# EAGLE design fff (EAGLE 4.13)
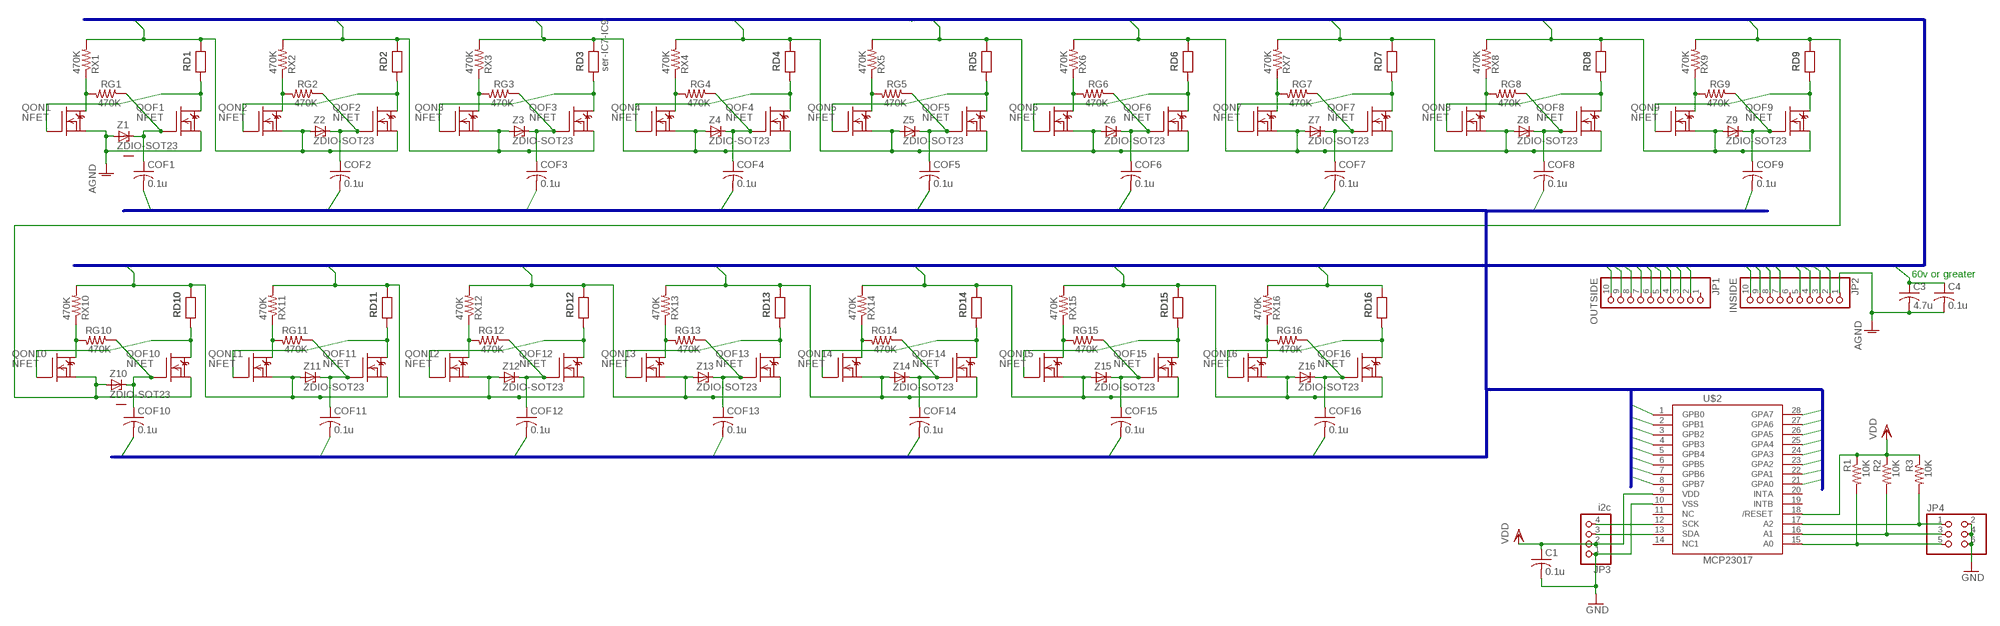
[diagram p0: schematic, sheet 1]

## Parts
C1  0.1u  C-USC0603  [C0603]
C3  4.7u  C-USC0805  [C0805]
C4  0.1u  C-USC0603  [C0603]
COF1  0.1u  C-USC0603  [C0603]
COF2  0.1u  C-USC0603  [C0603]
COF3  0.1u  C-USC0603  [C0603]
COF4  0.1u  C-USC0603  [C0603]
COF5  0.1u  C-USC0603  [C0603]
COF6  0.1u  C-USC0603  [C0603]
COF7  0.1u  C-USC0603  [C0603]
COF8  0.1u  C-USC0603  [C0603]
COF9  0.1u  C-USC0603  [C0603]
COF10  0.1u  C-USC0603  [C0603]
COF11  0.1u  C-USC0603  [C0603]
COF12  0.1u  C-USC0603  [C0603]
COF13  0.1u  C-USC0603  [C0603]
COF14  0.1u  C-USC0603  [C0603]
COF15  0.1u  C-USC0603  [C0603]
COF16  0.1u  C-USC0603  [C0603]
JP1  OUTSIDE  PINHD-1X10  [1X10]
JP2  INSIDE  PINHD-1X10  [1X10]
JP3  i2c  PINHD-1X4  [1X04]
JP4  PINHD-2X3  [2X03]
QOF1  NFET  DMN3404L  [SOT-23]
QOF2  NFET  DMN3404L  [SOT-23]
QOF3  NFET  DMN3404L  [SOT-23]
QOF4  NFET  DMN3404L  [SOT-23]
QOF5  NFET  DMN3404L  [SOT-23]
QOF6  NFET  DMN3404L  [SOT-23]
QOF7  NFET  DMN3404L  [SOT-23]
QOF8  NFET  DMN3404L  [SOT-23]
QOF9  NFET  DMN3404L  [SOT-23]
QOF10  NFET  DMN3404L  [SOT-23]
QOF11  NFET  DMN3404L  [SOT-23]
QOF12  NFET  DMN3404L  [SOT-23]
QOF13  NFET  DMN3404L  [SOT-23]
QOF14  NFET  DMN3404L  [SOT-23]
QOF15  NFET  DMN3404L  [SOT-23]
QOF16  NFET  DMN3404L  [SOT-23]
QON1  NFET  DMN3404L  [SOT-23]
QON2  NFET  DMN3404L  [SOT-23]
QON3  NFET  DMN3404L  [SOT-23]
QON4  NFET  DMN3404L  [SOT-23]
QON5  NFET  DMN3404L  [SOT-23]
QON6  NFET  DMN3404L  [SOT-23]
QON7  NFET  DMN3404L  [SOT-23]
QON8  NFET  DMN3404L  [SOT-23]
QON9  NFET  DMN3404L  [SOT-23]
QON10  NFET  DMN3404L  [SOT-23]
QON11  NFET  DMN3404L  [SOT-23]
QON12  NFET  DMN3404L  [SOT-23]
QON13  NFET  DMN3404L  [SOT-23]
QON14  NFET  DMN3404L  [SOT-23]
QON15  NFET  DMN3404L  [SOT-23]
QON16  NFET  DMN3404L  [SOT-23]
R1  10K  R-US_R0603  [R0603]
R2  10K  R-US_R0603  [R0603]
R3  10K  R-US_R0603  [R0603]
RD1  RESEU-S2,5  [RS-2,5@1]
RD2  RESEU-S2,5  [RS-2,5@1]
RD3  ser-IC7-IC9  RESEU-S2,5  [RS-2,5@1]
RD4  RESEU-S2,5  [RS-2,5@1]
RD5  RESEU-S2,5  [RS-2,5@1]
RD6  RESEU-S2,5  [RS-2,5@1]
RD7  RESEU-S2,5  [RS-2,5@1]
RD8  RESEU-S2,5  [RS-2,5@1]
RD9  RESEU-S2,5  [RS-2,5@1]
RD10  RESEU-S2,5  [RS-2,5@1]
RD11  RESEU-S2,5  [RS-2,5@1]
RD12  RESEU-S2,5  [RS-2,5@1]
RD13  RESEU-S2,5  [RS-2,5@1]
RD14  RESEU-S2,5  [RS-2,5@1]
RD15  RESEU-S2,5  [RS-2,5@1]
RD16  RESEU-S2,5  [RS-2,5@1]
RG1  470K  R-US_R0603  [R0603]
RG2  470K  R-US_R0603  [R0603]
RG3  470K  R-US_R0603  [R0603]
RG4  470K  R-US_R0603  [R0603]
RG5  470K  R-US_R0603  [R0603]
RG6  470K  R-US_R0603  [R0603]
RG7  470K  R-US_R0603  [R0603]
RG8  470K  R-US_R0603  [R0603]
RG9  470K  R-US_R0603  [R0603]
RG10  470K  R-US_R0603  [R0603]
RG11  470K  R-US_R0603  [R0603]
RG12  470K  R-US_R0603  [R0603]
RG13  470K  R-US_R0603  [R0603]
RG14  470K  R-US_R0603  [R0603]
RG15  470K  R-US_R0603  [R0603]
RG16  470K  R-US_R0603  [R0603]
RX1  470K  R-US_R0603  [R0603]
RX2  470K  R-US_R0603  [R0603]
RX3  470K  R-US_R0603  [R0603]
RX4  470K  R-US_R0603  [R0603]
RX5  470K  R-US_R0603  [R0603]
RX6  470K  R-US_R0603  [R0603]
RX7  470K  R-US_R0603  [R0603]
RX8  470K  R-US_R0603  [R0603]
RX9  470K  R-US_R0603  [R0603]
RX10  470K  R-US_R0603  [R0603]
RX11  470K  R-US_R0603  [R0603]
RX12  470K  R-US_R0603  [R0603]
RX13  470K  R-US_R0603  [R0603]
RX14  470K  R-US_R0603  [R0603]
RX15  470K  R-US_R0603  [R0603]
RX16  470K  R-US_R0603  [R0603]
U$2  MCP23017  [SO28W]
Z1  ZDIO-SOT23  [SOT-23]
Z2  ZDIO-SOT23  [SOT-23]
Z3  ZDIO-SOT23  [SOT-23]
Z4  ZDIO-SOT23  [SOT-23]
Z5  ZDIO-SOT23  [SOT-23]
Z6  ZDIO-SOT23  [SOT-23]
Z7  ZDIO-SOT23  [SOT-23]
Z8  ZDIO-SOT23  [SOT-23]
Z9  ZDIO-SOT23  [SOT-23]
Z10  ZDIO-SOT23  [SOT-23]
Z11  ZDIO-SOT23  [SOT-23]
Z12  ZDIO-SOT23  [SOT-23]
Z13  ZDIO-SOT23  [SOT-23]
Z14  ZDIO-SOT23  [SOT-23]
Z15  ZDIO-SOT23  [SOT-23]
Z16  ZDIO-SOT23  [SOT-23]

## Nets
AGND: C3.2 C4.2 JP2.1 QOF1.2(S) QON1.2(S) Z1.1(A)
C0: C3.1 C4.1 JP1.10
C1: JP1.5 QOF2.2(S) QON2.2(S) RD1.2 RX1.2 Z2.1(A) Z2.2(NC)
C2: JP2.10 QOF3.2(S) QON3.2(S) RD2.2 RX2.2 Z3.1(A) Z3.2(NC)
C3: JP2.5 QOF4.2(S) QON4.2(S) RD3.2 RX3.2 Z4.1(A) Z4.2(NC)
C4: JP1.9 QOF5.2(S) QON5.2(S) RD4.2 RX4.2 Z5.1(A) Z5.2(NC)
C5: JP1.4 QOF6.2(S) QON6.2(S) RD5.2 RX5.2 Z6.1(A) Z6.2(NC)
C6: JP2.9 QOF7.2(S) QON7.2(S) RD6.2 RX6.2 Z7.1(A) Z7.2(NC)
C7: JP2.4 QOF8.2(S) QON8.2(S) RD7.2 RX7.2 Z8.1(A) Z8.2(NC)
C8: JP1.8 QOF9.2(S) QON9.2(S) RD8.2 RX8.2 Z9.1(A) Z9.2(NC)
C9: JP1.3 QOF10.2(S) QON10.2(S) RD9.2 RX9.2 Z10.1(A)
C10: JP2.8 QOF11.2(S) QON11.2(S) RD10.2 RX10.2 Z11.1(A) Z11.2(NC)
C11: JP2.3 QOF12.2(S) QON12.2(S) RD11.2 RX11.2 Z12.1(A) Z12.2(NC)
C12: JP1.7 QOF13.2(S) QON13.2(S) RD12.2 RX12.2 Z13.1(A) Z13.2(NC)
C13: JP1.2 QOF14.2(S) QON14.2(S) RD13.2 RX13.2 Z14.1(A) Z14.2(NC)
C14: JP2.7 QOF15.2(S) QON15.2(S) RD14.2 RX14.2 Z15.1(A) Z15.2(NC)
C15: JP2.2 QOF16.2(S) QON16.2(S) RD15.2 RX15.2 Z16.1(A) Z16.2(NC)
C16: JP1.6 RD16.2 RX16.2
GND: C1.2 JP3.1 JP4.2 JP4.4 JP4.6 U$2.10(VSS)
GPA0: COF16.2 U$2.21(GPA0)
GPA1: COF15.2 U$2.22(GPA1)
GPA2: COF14.2 U$2.23(GPA2)
GPA3: COF13.2 U$2.24(GPA3)
GPA4: COF12.2 U$2.25(GPA4)
GPA5: COF11.2 U$2.26(GPA5)
GPA6: COF10.2 U$2.27(GPA6)
GPA7: COF1.2 U$2.28(GPA7)
GPB0: COF2.2 U$2.1(GPB0)
GPB1: COF3.2 U$2.2(GPB1)
GPB2: COF4.2 U$2.3(GPB2)
GPB3: COF5.2 U$2.4(GPB3)
GPB4: COF6.2 U$2.5(GPB4)
GPB5: COF7.2 U$2.6(GPB5)
GPB6: COF8.2 U$2.7(GPB6)
GPB7: COF9.2 U$2.8(GPB7)
N$2: JP4.5 R1.2 U$2.15(A0)
N$3: JP4.3 R2.2 U$2.16(A1)
N$4: JP4.1 R3.2 U$2.17(A2)
N$5: JP3.4 U$2.12(SCK)
N$6: QOF10.3(D) QON10.1(G) RD10.1
N$7: JP3.3 U$2.13(SDA)
N$69: COF1.1 QOF1.1(G) RG1.1 Z1.3(C)
N$70: QOF1.3(D) QON1.1(G) RD1.1
N$71: QON1.3(D) RG1.2 RX1.1
N$72: QON2.3(D) RG2.2 RX2.1
N$73: QON3.3(D) RG3.2 RX3.1
N$74: COF2.1 QOF2.1(G) RG2.1 Z2.3(C)
N$75: QOF2.3(D) QON2.1(G) RD2.1
N$77: QON4.3(D) RG4.2 RX4.1
N$78: QON5.3(D) RG5.2 RX5.1
N$79: QON6.3(D) RG6.2 RX6.1
N$80: COF3.1 QOF3.1(G) RG3.1 Z3.3(C)
N$81: QOF3.3(D) QON3.1(G) RD3.1
N$82: QON7.3(D) RG7.2 RX7.1
N$83: QON8.3(D) RG8.2 RX8.1
N$84: QON9.3(D) RG9.2 RX9.1
N$85: QON10.3(D) RG10.2 RX10.1
N$86: COF4.1 QOF4.1(G) RG4.1 Z4.3(C)
N$87: QOF4.3(D) QON4.1(G) RD4.1
N$88: COF5.1 QOF5.1(G) RG5.1 Z5.3(C)
N$89: QOF5.3(D) QON5.1(G) RD5.1
N$90: QON11.3(D) RG11.2 RX11.1
N$91: QON12.3(D) RG12.2 RX12.1
N$92: QON13.3(D) RG13.2 RX13.1
N$93: QON14.3(D) RG14.2 RX14.1
N$94: QON15.3(D) RG15.2 RX15.1
N$95: QON16.3(D) RG16.2 RX16.1
N$126: COF6.1 QOF6.1(G) RG6.1 Z6.3(C)
N$127: QOF6.3(D) QON6.1(G) RD6.1
N$132: COF7.1 QOF7.1(G) RG7.1 Z7.3(C)
N$133: QOF7.3(D) QON7.1(G) RD7.1
N$138: COF8.1 QOF8.1(G) RG8.1 Z8.3(C)
N$139: QOF8.3(D) QON8.1(G) RD8.1
N$144: COF9.1 QOF9.1(G) RG9.1 Z9.3(C)
N$145: QOF9.3(D) QON9.1(G) RD9.1
N$150: COF10.1 QOF10.1(G) RG10.1 Z10.3(C)
N$154: COF11.1 QOF11.1(G) RG11.1 Z11.3(C)
N$155: QOF11.3(D) QON11.1(G) RD11.1
N$158: COF12.1 QOF12.1(G) RG12.1 Z12.3(C)
N$159: QOF12.3(D) QON12.1(G) RD12.1
N$162: COF13.1 QOF13.1(G) RG13.1 Z13.3(C)
N$163: QOF13.3(D) QON13.1(G) RD13.1
N$174: COF14.1 QOF14.1(G) RG14.1 Z14.3(C)
N$175: QOF14.3(D) QON14.1(G) RD14.1
N$179: COF15.1 QOF15.1(G) RG15.1 Z15.3(C)
N$180: QOF15.3(D) QON15.1(G) RD15.1
N$184: COF16.1 QOF16.1(G) RG16.1 Z16.3(C)
N$185: QOF16.3(D) QON16.1(G) RD16.1
VDD: C1.1 JP3.2 R1.1 R2.1 R3.1 U$2.9(VDD) U$2.18(/RESET)
Unconnected: JP1.1 JP2.6 U$2.11(NC) U$2.14(NC1) U$2.19(INTB) U$2.20(INTA) Z1.2(NC) Z10.2(NC)

## Buses
C$1:C[0..18]
GP:GPA[0..7],GPB[0..7]

## Notes on the sheet
- 60v or greater

## Library data of the parts
C1 C3 C4 COF1-COF16 = rcl:C-US: CAPACITOR, American symbol
JP1 JP2 = pinhead:PINHD-1X10: PIN HEADER
JP3 = pinhead:PINHD-1X4: PIN HEADER
JP4 = pinhead:PINHD-2X3: PIN HEADER
QOF1-QOF16 QON1-QON16 = transistor-fet:DMN3404L
R1-R3 RG1-RG16 RX1-RX16 = rcl:R-US_: RESISTOR, American symbol
RD1-RD16 = DEH:RESEU-S2,5
U$2 = 74xx-us:MCP23017
Z1-Z16 = DEH:ZDIO-SOT23

## Board
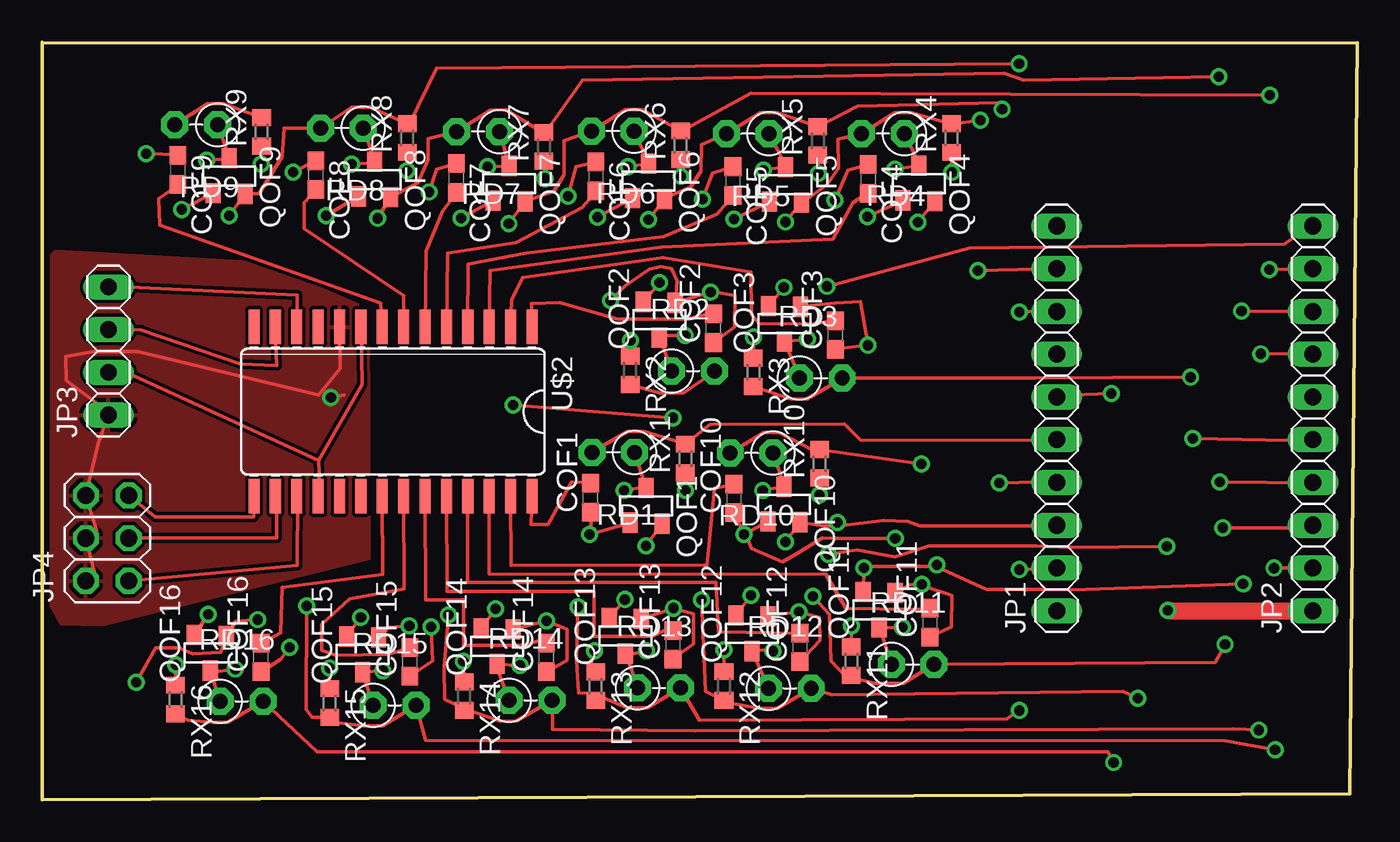
[diagram p1: board, top side]
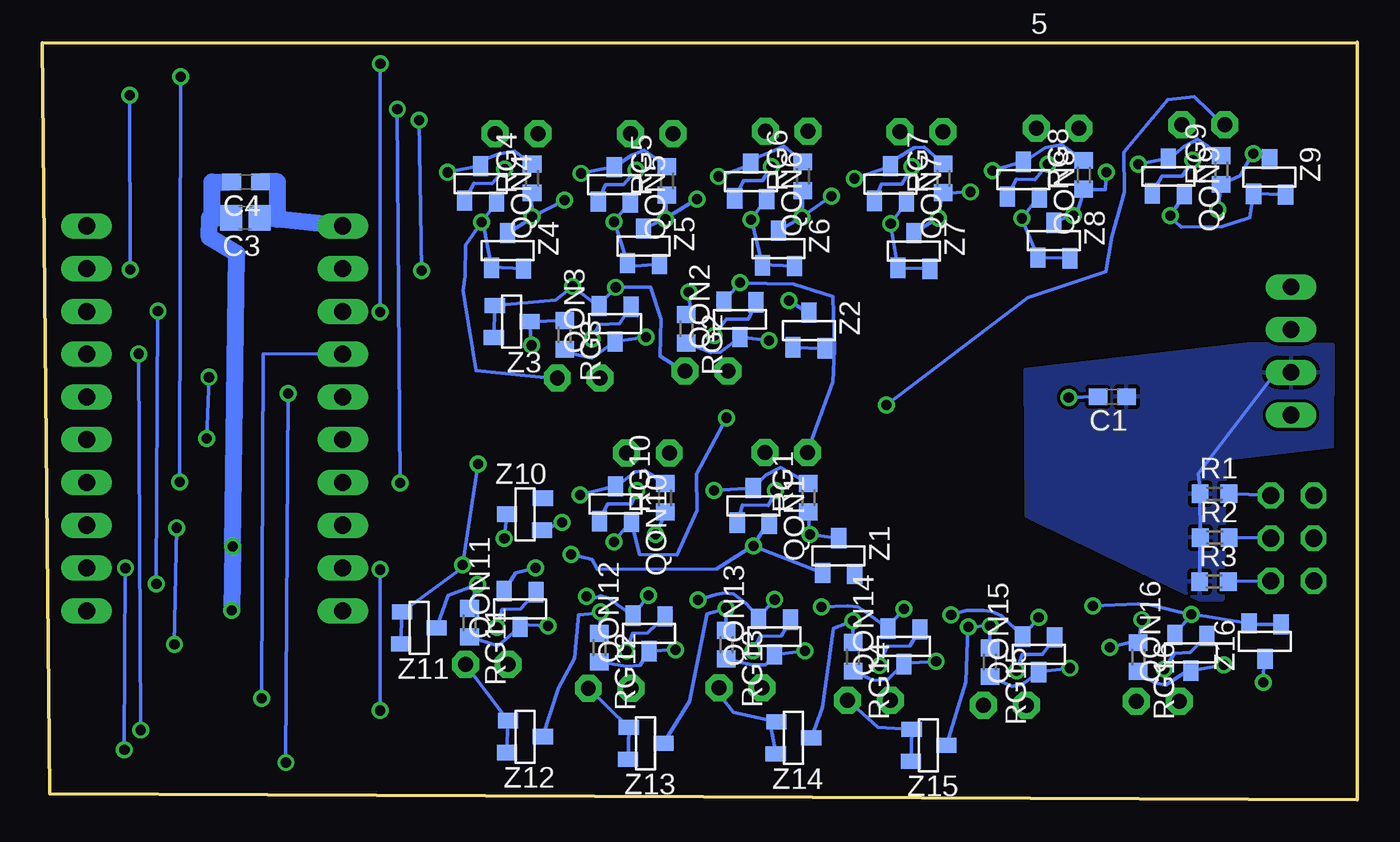
[diagram p2: board, bottom side, seen from below]

Size 78.12 x 45.02 mm. Coordinates in mm from the lower left corner, seen from the top.
Outline: 0,45.02 0.01,0 77.66,0.37 78.12,44.97 0.08,44.94
Copper layers (1*16): Top 0.035mm / dielectric 1.5mm / Bottom 0.035mm
Design rules "default": minimum track width 8mil, minimum drill 0.6mm, track to track 8mil, track to pad 8mil, pad to pad 8mil, via to via 8mil, smd to smd 0mil, copper to edge 8mil, drill to drill 8mil, minimum pad ring 10mil, minimum via ring 8mil, stop-mask expansion 4mil, vias tented up to drill 0mil, thermal gap 10mil

### Footprints (pad centres in the part's own frame; a part is rotated, then mirrored left to right if it is on the bottom)
C0603 = smd 1.1 x 1: 1 -0.85,0; 2 0.85,0
C0805 = smd 1.3 x 1.5: 1 -0.85,0; 2 0.85,0
1X10 = drill 1.016 long: 1 -11.43,0; 2 -8.89,0; 3 -6.35,0; 4 -3.81,0; 5 -1.27,0; 6 1.27,0; 7 3.81,0; 8 6.35,0; 9 8.89,0; 10 11.43,0
1X04 = drill 1 long: 1 -3.81,0; 2 -1.27,0; 3 1.27,0; 4 3.81,0
2X03 = drill 1.016 octagon: 1 -2.54,-1.27; 2 -2.54,1.27; 3 0,-1.27; 4 0,1.27; 5 2.54,-1.27; 6 2.54,1.27
SOT-23 = smd 0.9 x 1.2: 1 -1,-1.006; 2 0.9,-1.056; 3 -0.05,1.056
R0603 = smd 1 x 1.1: 1 -0.85,0; 2 0.85,0
RS-2,5@1 = drill 0.889 pad 1.6 octagon: 1 0,0; 2 2.54,0
SO28W = smd 0.66 x 2.032: 1 -8.255,-5.029; 2 -6.985,-5.029; 3 -5.715,-5.029; 4 -4.445,-5.029; 5 -3.175,-5.029; 6 -1.905,-5.029; 7 -0.635,-5.029; 8 0.635,-5.029; 9 1.905,-5.029; 10 3.175,-5.029; 11 4.445,-5.029; 12 5.715,-5.029; 13 6.985,-5.029; 14 8.255,-5.029; 15 8.255,5.029; 16 6.985,5.029; 17 5.715,5.029; 18 4.445,5.029; 19 3.175,5.029; 20 1.905,5.029; 21 0.635,5.029; 22 -0.635,5.029; 23 -1.905,5.029; 24 -3.175,5.029; 25 -4.445,5.029; 26 -5.715,5.029; 27 -6.985,5.029; 28 -8.255,5.029

### Placement (x,y rotation side)
C1  14.56,23.95 180 bottom
C3  66.04,34.58 180 bottom
C4  66.01,36.71 180 bottom
COF1  32.57,17.95 90 top
COF2  39.87,28.02 90 top
COF3  47.11,27.62 90 top
COF4  49.06,36.89 270 top
COF5  41.03,36.77 270 top
COF6  32.89,37.04 270 top
COF7  24.6,36.95 270 top
COF8  16.26,37.12 270 top
COF9  8.07,37.43 270 top
COF10  41.1,17.9 90 top
COF11  52.74,10.53 90 top
COF12  45.02,9.06 90 top
COF13  37.48,9.22 90 top
COF14  29.95,8.47 90 top
COF15  21.84,8.2 90 top
COF16  13.01,8.47 90 top
JP1  60.26,22.67 90 top
JP2  75.48,22.67 90 top
JP3  3.94,26.67 90 top
JP4  3.87,15.55 90 top
QOF1  35.92,17.47 0 top
QOF2  36.61,28.53 180 top
QOF3  44.04,28.29 180 top
QOF4  52.12,36.62 0 top
QOF5  44.21,36.54 0 top
QOF6  36.07,36.75 0 top
QOF7  27.79,36.61 0 top
QOF8  19.79,36.86 0 top
QOF9  11.17,37.06 0 top
QOF10  44.12,17.55 0 top
QOF11  49.67,11.3 180 top
QOF12  42.12,9.9 180 top
QOF13  34.59,9.75 180 top
QOF14  26.97,9.13 180 top
QOF15  18.98,8.65 180 top
QOF16  9.95,8.74 180 top
QON1  35.83,17.47 0 bottom
QON2  36.72,28.55 180 bottom
QON3  44.15,28.29 180 bottom
QON4  52.03,36.6 0 bottom
QON5  44.09,36.54 0 bottom
QON6  35.98,36.74 0 bottom
QON7  27.69,36.59 0 bottom
QON8  19.79,36.84 0 bottom
QON9  11.18,37.04 0 bottom
QON10  44.02,17.57 0 bottom
QON11  49.78,11.34 180 bottom
QON12  42.12,9.89 180 bottom
QON13  34.68,9.7 180 bottom
QON14  26.99,9.12 180 bottom
QON15  18.98,8.65 180 bottom
QON16  9.95,8.74 180 bottom
R1  8.49,18.19 0 bottom
R2  8.47,15.59 0 bottom
R3  8.52,12.97 0 bottom
RD1  35.19,20.64 180 top
RD2  37.39,25.48 0 top
RD3  44.98,25.06 0 top
RD4  51.21,39.59 180 top
RD5  43.18,39.57 180 top
RD6  35.16,39.73 180 top
RD7  27.16,39.7 180 top
RD8  19.07,39.91 180 top
RD9  10.42,40.1 180 top
RD10  43.41,20.6 180 top
RD11  50.44,8.05 0 top
RD12  43.14,6.63 0 top
RD13  35.37,6.65 0 top
RD14  27.74,5.92 0 top
RD15  19.67,5.63 0 top
RD16  10.58,5.86 0 top
RG1  32.61,17.95 90 bottom
RG2  39.85,27.99 270 bottom
RG3  47.08,27.62 270 bottom
RG4  49.02,36.91 90 bottom
RG5  41.01,36.78 90 bottom
RG6  32.94,37.05 90 bottom
RG7  24.6,36.93 90 bottom
RG8  16.26,37.14 90 bottom
RG9  8.09,37.42 90 bottom
RG10  41.11,17.95 90 bottom
RG11  52.73,10.53 270 bottom
RG12  45.02,9.05 270 bottom
RG13  37.48,9.22 270 bottom
RG14  29.95,8.5 270 bottom
RG15  21.82,8.18 270 bottom
RG16  13.02,8.49 270 bottom
RX1  38.21,20.28 90 top
RX2  34.93,25.52 270 top
RX3  42.24,25.41 270 top
RX4  54.02,39.32 90 top
RX5  46.07,39.15 90 top
RX6  37.93,38.89 90 top
RX7  29.81,38.8 90 top
RX8  21.68,39.32 90 top
RX9  13.04,39.68 90 top
RX10  46.18,19.97 90 top
RX11  48.06,8.25 270 top
RX12  40.5,6.77 270 top
RX13  32.88,6.76 270 top
RX14  25.07,6.17 270 top
RX15  17.08,5.76 270 top
RX16  7.93,5.97 270 top
U$2  20.84,23.07 180 top
Z1  30.76,14.49 0 bottom
Z2  32.52,27.89 0 bottom
Z3  50.23,28.37 270 bottom
Z4  50.42,32.62 0 bottom
Z5  42.35,32.89 0 bottom
Z6  34.33,32.76 0 bottom
Z7  26.29,32.61 0 bottom
Z8  17.98,33.23 0 bottom
Z9  5.17,37.01 0 bottom
Z10  49.44,17.02 90 bottom
Z11  55.74,10.17 270 bottom
Z12  49.44,3.71 270 bottom
Z13  42.27,3.31 270 bottom
Z14  33.49,3.63 270 bottom
Z15  25.47,3.2 270 bottom
Z16  5.54,9.43 180 bottom

### Tracks (layer width: path | path; a pad name or v marks a point on that pad's centre or on a via)
AGND  (via drill 0.6)
  Top 0.203: v35.87,15.1 QOF1.2 | v66.81,15.05 61.11,15 59.06,15.08 52.68,15.1 50.66,14.43 48.4,14.86 v46.7,14.59
  Top 0.406: 67.05,11.26 67.05,11.38 | v66.85,11.26 67.05,11.26 | 67.05,11.26 67.05,11.24
  Top 1.016: 67.05,11.24 JP2.1
  Bottom 0.203: QON1.2 35.02,16.51 v35.87,15.1 | v46.7,14.59 45.47,14.3 45.12,13.69 38.07,13.73 35.87,15.12 v35.87,15.1 | v35.87,15.1 35.89,15.08 Z1.1
  Bottom 0.406: 68.17,34.55 68.17,34.58 | 68.16,34.55 68.02,34.55 | C4.2 66.98,36.71 66.98,36.7 66.98,36.63
  Bottom 1.016: v66.85,11.26 v66.81,15.05 66.55,32.46 68.19,33.43 68.16,34.55 68.17,34.55 | 68.17,34.58 C3.2 | 68.02,34.55 68.02,36.7 66.98,36.7
C0
  Bottom 0.406: 64.14,34.5 64.17,34.5 64.17,34.58 65.03,34.58 C3.1 | C4.1 | C4.1 | C4.1
  Bottom 1.016: 64.14,34.5 64.14,36.72 C4.1 | JP1.10 65.03,34.58
C1  (via drill 0.6)
  Top 0.203: v36.68,30.74 QOF2.2 | RD1.2 32.65,20.68 34.78,21.89 35.77,21.88 RX1.2 39.68,22.31 47.66,22.33 48.59,21.38 60.32,21.36 JP1.5
  Bottom 0.203: QON2.2 37.6,29.63 v36.68,30.74 36.64,30.69 33.49,30.63 31.14,29.89 31.05,26.75 | 32.39,21.43 32.66,20.69 | 32.39,21.43 31.14,24.85 31.05,26.75 | Z2.1 31.71,26.82 Z2.2 31.49,26.67 31.05,26.75 | 32.39,21.43 32.41,21.44 RD1.2
C2  (via drill 0.6)
  Top 0.203: RX2.2 36.66,24.16 38.11,24.18 40.02,25.51 RD2.2 | v44.05,30.45 QOF3.2 | v46.61,30.51 55.07,32.78 73.77,33.01 75.78,34.37 JP2.10
  Bottom 0.203: 45.09,29.34 QON3.2 | 45.09,29.34 v44.05,30.45 44.08,30.48 41.97,30.48 41.36,28.58 41.42,26.36 40.02,25.47 RD2.2 | 45.09,29.34 v46.61,30.51 46.63,30.46 47.61,29.7 Z3.1 51.25,29.35 Z3.2
C3  (via drill 0.6)
  Top 0.203: RX3.2 44.48,23.81 45.43,23.81 47.54,25.04 RD3.2 59,25.06 v68.21,25.11 | v52.01,34.32 QOF4.2 | JP2.5 75.59,21.32 v68.35,21.46
  Bottom 0.203: QON4.2 51.09,35.54 v52.01,34.32 | v68.21,25.11 v68.35,21.46 | v52.01,34.32 52.98,32.95 52.99,31.12 53.11,30.26 52.99,29.53 52.35,25.5 47.69,25.04 RD3.2 | Z4.2 51.47,31.66 Z4.1 51.94,34.29 v52.01,34.32
C4  (via drill 0.6)
  Top 0.203: 54.04,40.14 RX4.2 | 54.04,40.14 51.62,40.82 50.64,40.82 RD4.2 47.27,39.24 47.29,37.52 46.65,36.59 45.13,35.46 QOF5.2 v44.15,34.34 | 54.04,40.14 v55.72,40.37 | JP1.9 60.3,31.55 v55.57,31.45
  Bottom 0.203: QON5.2 43.22,35.47 v44.15,34.34 44.13,34.31 Z5.1 43.61,31.64 Z5.2 | v55.72,40.37 v55.57,31.45
C5  (via drill 0.6)
  Top 0.203: v36.02,34.47 QOF6.2 37.01,35.76 38.5,36.39 39.14,37.35 39.15,38.94 RD5.2 42.66,40.83 43.65,40.84 46.1,40 RX5.2 48.42,41.22 56.82,41.43 v57.02,41.03 | JP1.4 60.29,18.92 v56.86,18.82
  Bottom 0.203: QON6.2 35.13,35.7 v36.02,34.47 35.99,34.48 Z6.1 35.42,31.79 Z6.2 | v57.02,41.03 v56.86,18.82
C6  (via drill 0.6)
  Top 0.203: 37.97,39.74 RX6.2 | 37.97,39.74 35.62,41 34.64,41 RD6.2 31.01,39.17 31.01,37.15 30.41,36.18 28.7,35.58 QOF7.2 v27.72,34.24 | 37.97,39.74 42.1,41.97 v72.92,41.86 | JP2.9 75.55,31.57 v72.88,31.51
  Bottom 0.203: QON7.2 26.76,35.56 v27.72,34.24 v27.73,34.25 Z7.1 Z7.2 | v72.92,41.86 v72.88,31.51
C7  (via drill 0.6)
  Top 0.203: 29.84,39.59 RX7.2 | 29.84,39.59 27.52,40.99 26.65,40.97 RD7.2 22.93,39.29 22.93,38.03 22.34,36.68 20.68,35.78 QOF8.2 v19.92,34.55 | 29.84,39.59 32.1,42.77 57.11,43.17 58.3,42.77 v69.9,42.96 | JP2.4 75.55,18.84 v69.94,18.89
  Bottom 0.203: QON8.2 18.94,35.82 v19.92,34.55 19.94,34.54 Z8.1 19.04,32.21 Z8.2 | v69.9,42.96 v69.94,18.89
C8  (via drill 0.6)
  Top 0.203: 21.79,40.12 RX8.2 | 21.79,40.12 19.48,41.16 18.39,41.15 RD8.2 14.39,39.92 14.25,38.2 12.9,36.03 12.12,36.03 QOF9.2 v11.11,34.71 | 21.79,40.12 23.42,43.48 v58.03,43.73 | JP1.8 60.41,29.09 v58.05,28.98
  Bottom 0.203: QON9.2 10.26,36.02 v11.11,34.71 11.2,34.72 10.47,34.03 8.06,34.05 6.38,34.6 Z9.1 6.2,36.02 Z9.2 | v58.03,43.73 v58.05,28.98
C9  (via drill 0.6)
  Top 0.203: v44.15,15.32 QOF10.2 46.45,16.28 47.33,16.28 | JP1.3 60.31,16.28 52.13,16.28 51.42,16.55 49.97,16.59 47.33,16.28 | RD9.2 9.83,41.37 10.79,41.36 RX9.2 | v27.97,23.45 v37.47,22.7 | 47.33,16.28 47.33,16.31 v47.24,16.49
  Bottom 0.203: v44.15,15.32 43.17,16.53 QON10.2 42.64,14.58 40.41,14.55 39.23,17.2 39.25,19.37 v37.47,22.7 | v27.97,23.45 19.57,29.83 14.95,31.39 14.59,33.47 13.85,36.12 13.88,38.49 11.25,41.6 9.7,41.77 7.87,40.03 RD9.2 | v47.24,16.49 Z10.1
C10  (via drill 0.6)
  Top 0.203: 48.74,12.32 QOF11.2 v48.81,13.78 48.95,13.86 52.6,13.86 | RD10.2 42.88,21.82 43.78,21.83 45.68,20.81 RX10.2 46.12,20.83 v52.23,19.95 | v71.24,29.03 JP2.8 | v71.33,12.83 61.13,12.48 59.35,12.51 56.07,12.52 53.15,13.85 52.6,13.86 | 52.6,13.86 52.6,13.87 v53.14,13.97
  Bottom 0.203: QON11.2 50,13.5 v48.81,13.78 | v71.33,12.83 v71.24,29.03 | v52.23,19.95 v53.14,13.97 53.09,13.85 Z11.1 56.77,11.13 Z11.2
C11  (via drill 0.6)
  Top 0.203: 48.12,7.25 RX11.2 | 48.12,7.25 49.46,6.92 51.15,6.93 RD11.2 69.67,8.17 v70.26,9.24 | 48.12,7.25 47.71,7.33 46.85,8.26 46.76,11.01 v45.79,12.1 | QOF12.2 41.2,10.95 v42.11,12.14 | JP2.3 75.47,16.17 v70.13,16.17
  Bottom 0.203: v45.79,12.1 45.29,11.99 44.96,12.13 44.51,11.99 QON12.2 v42.11,12.14 | v70.26,9.24 v70.13,16.17 | Z12.2 50.48,4.74 Z12.1 53,8.08 RD11.2
C12  (via drill 0.6)
  Top 0.203: v34.61,11.9 QOF13.2 | v39.16,11.89 39.39,6.46 RX12.2 41.13,5.7 42.59,5.43 43.67,5.45 RD12.2 46.91,6.25 64.2,6.46 v65.07,6.03
  Bottom 0.203: v34.61,11.9 35.61,10.79 QON13.2 35.58,10.85 36.31,11.66 37.06,12.23 37.6,12.31 38.07,12.21 v39.16,11.89 | v65.07,6.03 64.99,26.48 60.34,26.52 JP1.7 | Z13.2 43.26,4.23 Z13.1 45.65,6.59 RD12.2
C13  (via drill 0.6)
  Top 0.203: 32.72,6.32 RX13.2 | 32.72,6.32 34.74,5.48 35.97,5.48 RD13.2 39.06,4.72 57.3,4.82 v58.04,5.31 | v26.93,11.34 QOF14.2 | 32.72,6.32 31.86,6.36 31.73,8.25 v31.82,11.47 | JP1.2 60.3,13.74 v58.05,13.68
  Bottom 0.203: v26.93,11.34 27.98,10.19 QON14.2 27.89,10.2 29.14,11.12 29.67,11.48 30.25,11.52 v31.82,11.47 | v58.04,5.31 v58.05,13.68 | Z14.2 34.9,4.61 Z14.1 37.07,5.2 38.28,6.74 RD13.2
C14  (via drill 0.6)
  Top 0.203: 25.1,5.41 RX14.2 | 25.1,5.41 27.24,4.67 28.17,4.71 RD14.2 30.31,4.18 38.79,4.1 70.76,4.23 v72.26,4.15 | v18.93,10.85 QOF15.2 | 25.1,5.41 23.9,5.97 23.89,7.89 v24.13,10.99 | JP2.7 75.51,26.53 v72.38,26.5
  Bottom 0.203: v18.93,10.85 19.9,9.68 QON15.2 19.92,9.77 21.12,10.92 21.73,11.19 22.22,11.26 23.22,11.26 v24.13,10.99 | v72.26,4.15 v72.38,26.5 | Z15.2 26.47,4.17 Z15.1 28.48,4.3 30.3,5.94 RD14.2
C15  (via drill 0.6)
  Top 0.203: v9.86,11.02 QOF16.2 | v15.71,11.52 15.67,5.37 16.04,4.9 RX15.2 17.35,4.6 19.09,4.4 20.23,4.39 RD15.2 22.79,3.55 70.28,3.51 v73.23,2.97 | JP2.2 75.63,13.77 v73.17,13.77
  Bottom 0.203: QON16.2 10.88,9.77 v9.86,11.02 | v15.71,11.52 13.05,11.63 12.42,11.61 9.85,10.99 v9.86,11.02 | v73.23,2.97 v73.17,13.77 | Z16.1 6.52,10.42 Z16.2 9.88,11.04 v9.86,11.02
C16  (via drill 0.6)
  Top 0.203: RX16.2 8.68,4.72 10.11,4.61 11.03,4.62 RD16.2 16.33,2.86 63.3,2.87 v63.64,2.22 | JP1.6 60.34,24.01 v63.51,24.14
  Bottom 0.203: v63.64,2.22 v63.51,24.14
GND  (via drill 0.6)
  Top 0.203: JP4.2 3.16,13.34 JP4.4 3.23,15.98 JP4.6 3.34,21.16 3.99,23.01 1.42,24.9 1.4,26.35 3.06,26.64 5.69,26.64 16.43,24.06 17.7,25.64 17.67,28.15 | v17.15,23.91 17.95,24.06
  Bottom 0.203: C1.2 v17.15,23.91
  pour Top (rank 3): 0.8,32.6 12.91,31.92 19.37,29.17 19.43,14.36 3.57,10.39 1.13,10.45 0.55,11.53 0.57,32.38
GPA0
  Top 0.203: U$2.21 20.21,13.4 14.26,12.61 14.17,9.92 13,9.29 COF16.2
GPA1
  Top 0.203: U$2.22 21.5,12.53 18.26,11.93 16.6,10.43 16.6,8.87 17.46,8.6 20.54,8.64 COF15.2
GPA2
  Top 0.203: U$2.23 22.78,11.89 25.03,11.87 25.02,9.17 28.64,9.17 29.45,9.44 29.93,9.46 COF14.2
GPA3
  Top 0.203: U$2.24 24.04,12.4 32.78,12.39 32.78,9.73 36.24,9.73 36.96,10.08 37.52,10.11 COF13.2
GPA4
  Top 0.203: U$2.25 25.26,12.92 40.01,12.91 40.17,9.98 45.04,9.89 COF12.2
GPA5
  Top 0.203: U$2.26 26.55,13.44 46.55,13.4 47.75,11.38 51.76,11.32 52.76,11.38 COF11.2 52.78,11.41
GPA6
  Top 0.203: U$2.27 27.86,13.94 39.5,13.96 39.93,18.5 41.14,18.76 COF10.2
GPA7
  Top 0.203: 29.1,17.52 U$2.28 29.05,16.37 30.06,16.36 31.44,18.89 32.6,18.85 COF1.2
GPB0
  Top 0.203: U$2.1 29.06,29.49 30.73,29.54 34.19,28.57 38.31,28.57 39.68,28.9 COF2.2
GPB1
  Top 0.203: U$2.2 27.88,29.7 28.54,31.02 36.88,32.23 42.1,31.35 42.12,28.84 42.59,28.3 45.84,28.28 47.16,28.5 COF3.2
GPB2
  Top 0.203: U$2.3 26.61,31.44 36.8,32.83 46.98,33.33 48.16,35.49 49.08,36.09 COF4.2
GPB3
  Top 0.203: U$2.4 25.3,31.83 28.73,32.47 36.9,33.47 40.07,34.81 41.08,35.96 COF5.2
GPB4
  Top 0.203: U$2.5 24.08,32.48 28.14,33.11 32.08,35.19 32.95,36.19 COF6.2
GPB5
  Top 0.203: U$2.6 22.82,32.61 23.78,34.98 24.62,36.09 COF7.2
GPB6
  Top 0.203: U$2.7 21.46,29.95 15.57,33.94 15.57,35.48 16.28,36.24 COF8.2
GPB7
  Top 0.203: U$2.8 20.12,29.51 6.98,34.14 6.93,35.73 8.08,36.53 COF9.2
N$2
  Top 0.203: U$2.15 12.58,16.81 6.72,16.81 JP4.5
  Bottom 0.203: JP4.5 5.25,18.11 R1.2
N$3
  Top 0.203: JP4.3 13.93,15.55 13.93,17.94 U$2.16
  Bottom 0.203: JP4.3 5.11,15.56 R2.2
N$4
  Top 0.203: JP4.1 15.16,13.92 15.17,18.04 U$2.17
  Bottom 0.203: JP4.1 5.11,13 R3.2
N$5
  Top 0.203: U$2.12 15.14,29.99 3.93,30.53 JP3.4
N$6  (via drill 0.6)
  Top 0.203: RD10.1 44.11,18.57 QOF10.3 v42.8,18.38
  Bottom 0.203: QON10.1 44.55,17.57 43.12,17.58 v42.8,18.38
N$7
  Top 0.203: U$2.13 13.92,25.81 11.79,25.9 5.89,27.9 3.82,27.99 JP3.3
N$69  (via drill 0.6)
  Top 0.203: QOF1.1 v32.52,15.76 32.61,16.24 32.61,16.64 COF1.1
  Bottom 0.203: RG1.1 32.62,17.07 v32.52,15.76 32.47,15.78 Z1.3
N$70  (via drill 0.6)
  Top 0.203: RD1.1 35.87,18.57 QOF1.3 35.96,18.61 v34.57,18.39
  Bottom 0.203: QON1.1 36.51,17.52 34.99,17.48 v34.57,18.39
N$71  (via drill 0.6)
  Top 0.203: 38.21,19.45 RX1.1 v38.21,18.39
  Bottom 0.203: v38.21,18.39 QON1.3 35.85,18.57 35.14,19.3 34.27,19.74 RG1.2
N$72  (via drill 0.6)
  Top 0.203: RX2.1 v34.95,27.28
  Bottom 0.203: v34.95,27.28 36.68,27.51 QON2.3 36.64,27.51 37.82,26.61 38.4,26.59 RG2.2
N$73  (via drill 0.6)
  Top 0.203: RX3.1 v42.26,27.49
  Bottom 0.203: v42.26,27.49 44.12,27.22 QON3.3 45.46,26.25 46.66,26.51 RG3.2
N$74  (via drill 0.6)
  Top 0.203: COF2.1 41.12,28.1 41.14,29.95 39.81,30.21 v39.71,30.17 QOF2.1 37.7,30.84 37.37,31.55 36.77,31.68 36.09,31.54 34.66,30.54 v33.75,29.67
  Bottom 0.203: RG2.1 39.62,28.88 v39.71,30.17 | Z2.3 32.61,28.92 v33.75,29.67
N$75  (via drill 0.6)
  Top 0.203: RD2.1 QOF2.3 36.68,27.58 v38.2,27.58
  Bottom 0.203: QON2.1 36.18,28.56 37.47,28.58 v38.2,27.58
N$77  (via drill 0.6)
  Top 0.203: v54.04,37.28 RX4.1
  Bottom 0.203: v54.04,37.28 52.08,37.68 QON4.3 51.73,38.09 51.05,38.36 50.06,38.54 RG4.2
N$78  (via drill 0.6)
  Top 0.203: v46.1,37.22 RX5.1
  Bottom 0.203: v46.1,37.22 44.11,37.61 QON5.3 43.07,38.3 42.36,38.61 RG5.2
N$79  (via drill 0.6)
  Top 0.203: v37.95,37.04 RX6.1
  Bottom 0.203: v37.95,37.04 35.97,37.76 QON6.3 36.04,37.77 35.53,38.22 34.81,38.51 34.07,38.85 RG6.2
N$80  (via drill 0.6)
  Top 0.203: COF3.1 v49.06,27.01 49.05,27.04 48.59,29.59 47.1,29.51 QOF3.1
  Bottom 0.203: RG3.1 Z3.3 v49.06,27.01
N$81  (via drill 0.6)
  Top 0.203: RD3.1 45.02,25.06 QOF3.3 v45.46,27.37
  Bottom 0.203: QON3.1 43.83,28.29 45.04,28.25 v45.46,27.37
N$82  (via drill 0.6)
  Top 0.203: v29.87,36.92 RX7.1
  Bottom 0.203: v29.87,36.92 27.76,37.63 QON7.3 27.73,37.62 27.3,38.15 26.31,38.75 25.71,38.79 RG7.2
N$83  (via drill 0.6)
  Top 0.203: v21.69,37.38 RX8.1
  Bottom 0.203: v21.69,37.38 19.68,37.98 QON8.3 19.78,37.91 18.54,38.74 17.56,38.93 RG8.2
N$84  (via drill 0.6)
  Top 0.203: v13.02,37.76 RX9.1
  Bottom 0.203: v13.02,37.76 11.17,38.12 QON9.3 11.21,38.06 10.3,38.8 9.47,39.25 RG9.2
N$85  (via drill 0.6)
  Top 0.203: v46.17,18.11 RX10.1
  Bottom 0.203: RG10.2 42.33,19.57 42.91,19.48 44.06,18.59 QON10.3 44.08,18.66 v46.17,18.11
N$86  (via drill 0.6)
  Top 0.203: v49.03,34.66 QOF4.1 | COF4.1 47.86,37.41 v47.1,35.62
  Bottom 0.203: RG4.1 49.04,36.03 v49.03,34.66 | v49.03,34.66 49.03,34.57 Z4.3 | v49.03,34.66 49,34.65 v47.1,35.62
N$87  (via drill 0.6)
  Top 0.203: RD4.1 52.07,37.82 QOF4.3 52.11,37.67 v50.65,37.46
  Bottom 0.203: QON4.1 52.46,36.65 51.4,36.6 v50.65,37.46
N$88  (via drill 0.6)
  Top 0.203: v41.1,34.51 QOF5.1 | COF5.1 39.81,37.22 v39.22,35.69
  Bottom 0.203: RG5.1 41.03,35.95 v41.1,34.51 | v41.1,34.51 41.09,34.53 Z5.3 | v41.1,34.51 41.12,34.52 v39.22,35.69
N$89  (via drill 0.6)
  Top 0.203: RD5.1 44.21,37.61 QOF5.3 44.11,37.63 v42.84,37.41
  Bottom 0.203: QON5.1 44.65,36.54 43.58,36.55 v42.84,37.41
N$90  (via drill 0.6)
  Top 0.203: RX11.1 v48.07,10.34
  Bottom 0.203: v48.07,10.34 49.82,10.42 QON11.3 51.03,9.14 RG11.2
N$91  (via drill 0.6)
  Top 0.203: RX12.1 40.51,8.58 v40.49,8.91
  Bottom 0.203: v40.49,8.91 42.12,8.86 QON12.3 42.11,8.83 42.6,7.99 43.4,7.94 RG12.2
N$92  (via drill 0.6)
  Top 0.203: RX13.1 32.64,8.03 32.63,8.65 v32.8,8.86
  Bottom 0.203: v32.8,8.86 34.72,8.63 QON13.3 34.66,8.63 35.16,8.03 35.99,8.01 RG13.2
N$93  (via drill 0.6)
  Top 0.203: RX14.1 v25.02,8.23
  Bottom 0.203: v25.02,8.23 27,8.1 QON14.3 27,8.06 27.85,7.19 28.38,7.1 28.8,7.12 RG14.2
N$94  (via drill 0.6)
  Top 0.203: RX15.1 v17.08,7.83
  Bottom 0.203: v17.08,7.83 19.02,7.62 QON15.3 19,7.53 19.89,6.87 20.51,6.75 RG15.2
N$95  (via drill 0.6)
  Top 0.203: RX16.1 v7.93,8.03
  Bottom 0.203: v7.93,8.03 9.93,7.66 QON16.3 10.04,7.7 11.37,6.83 12.06,6.94 RG16.2
N$126  (via drill 0.6)
  Top 0.203: v32.98,34.62 QOF6.1 | COF6.1 31.71,37.62 v31.23,35.88
  Bottom 0.203: RG6.1 32.93,36.17 v32.98,34.62 | v32.98,34.62 32.9,34.66 Z6.3 | v32.98,34.62 33.03,34.63 v31.23,35.88
N$127  (via drill 0.6)
  Top 0.203: RD6.1 36.01,37.85 QOF6.3 36.03,37.79 v34.81,37.61
  Bottom 0.203: QON6.1 36.46,36.78 35.33,36.78 v34.81,37.61
N$132  (via drill 0.6)
  Top 0.203: v24.89,34.57 QOF7.1 | COF7.1 23.43,37.48 v22.98,36.12
  Bottom 0.203: Z7.3 24.85,34.62 v24.89,34.57 24.64,36.1 RG7.1 24.66,36.06 v22.98,36.12
N$133  (via drill 0.6)
  Top 0.203: RD7.1 27.74,37.72 QOF7.3 27.73,37.64 v26.47,37.63
  Bottom 0.203: QON7.1 28.28,36.59 27.04,36.59 v26.47,37.63
N$138  (via drill 0.6)
  Top 0.203: v16.86,34.72 QOF8.1 | v14.91,37.29 COF8.1
  Bottom 0.203: RG8.1 16.28,36.34 | Z8.3 16.66,34.9 v16.86,34.72 16.71,34.84 16.65,34.87 16.32,35.99 16.26,36.27 RG8.1 | v14.91,37.29 14.97,36.25 16.2,36.25 RG8.1
N$139  (via drill 0.6)
  Top 0.203: RD8.1 19.77,37.96 QOF8.3 19.82,37.87 v18.39,37.77
  Bottom 0.203: QON8.1 20.26,36.89 19.15,36.84 v18.39,37.77
N$144  (via drill 0.6)
  Top 0.203: v8.28,35.08 QOF9.1 | COF9.1 8.1,38.33 v6.18,38.4
  Bottom 0.203: v8.28,35.08 RG9.1 6.95,37.08 6.2,38.43 v6.18,38.4 Z9.3
N$145  (via drill 0.6)
  Top 0.203: RD9.1 11.12,38.17 QOF9.3 11.21,38.1 v9.78,38.01
  Bottom 0.203: QON9.1 11.61,37.07 10.4,37.05 v9.78,38.01
N$150  (via drill 0.6)
  Top 0.203: v41.69,15.76 QOF10.1 | v41.69,15.76 41.74,15.72 COF10.1 | v50.67,15.54 47.07,15.52 46.36,15.55 44.89,14.67 43.96,14.13 42.13,14.95 41.82,15.77 v41.69,15.76
  Bottom 0.203: RG10.1 41.1,17.03 v41.69,15.76 | v50.67,15.54 Z10.3
N$154  (via drill 0.6)
  Top 0.203: QOF11.1 50.73,12.34 51.5,12.77 v52.26,12.81 52.24,12.74 54.03,12.16 54,10.28 COF11.1
  Bottom 0.203: RG11.1 v52.26,12.81 v52.25,12.8 54.01,12.14 Z11.3
N$155  (via drill 0.6)
  Top 0.203: RD11.1 50.44,8.09 QOF11.3 49.67,10.23 v51.1,10.25
  Bottom 0.203: QON11.1 49.69,11.35 50.81,11.31 v51.1,10.25
N$158  (via drill 0.6)
  Top 0.203: QOF12.1 43.09,10.93 v44.96,11.18 44.9,11.17 46.18,10.85 46.2,9.49 COF12.1
  Bottom 0.203: RG12.1 v44.96,11.18 44.98,11.12 46.25,10.98 46.5,8.4 47.45,6.66 Z12.3
N$159  (via drill 0.6)
  Top 0.203: v43.41,8.84 42.15,8.93 QOF12.3 43.15,6.65 RD12.1
  Bottom 0.203: QON12.1 42.17,9.91 43.05,9.89 v43.41,8.84
N$162  (via drill 0.6)
  Top 0.203: QOF13.1 v37.5,11.39 v37.51,11.38 38.69,11.04 38.69,9.26 COF13.1
  Bottom 0.203: RG13.1 37.5,10.12 v37.5,11.39 37.53,11.36 38.62,11.06 39.67,5.87 Z13.3
N$163  (via drill 0.6)
  Top 0.203: RD13.1 35.4,6.68 QOF13.3 34.69,8.6 v35.9,8.86
  Bottom 0.203: QON13.1 34.21,9.74 35.47,9.73 v35.9,8.86
N$174  (via drill 0.6)
  Top 0.203: QOF14.1 v29.97,10.63 29.98,10.65 31.17,10.12 31.17,8.3 COF14.1
  Bottom 0.203: RG14.1 29.96,9.39 v29.97,10.63 v29.97,10.64 31.13,10.19 31.77,5.51 Z14.3
N$175  (via drill 0.6)
  Top 0.203: RD14.1 26.94,8.08 QOF14.3 26.98,8.04 v28.38,7.98
  Bottom 0.203: QON14.1 26.58,9.14 27.93,9.12 v28.38,7.98
N$179  (via drill 0.6)
  Top 0.203: QOF15.1 20.6,10.25 v21.81,10.34 | COF15.1 23.18,8.27 v23.1,10.28
  Bottom 0.203: RG15.1 21.85,9.14 v21.81,10.34 v21.82,10.33 v23.1,10.28 23.12,10.27 23.25,7.01 Z15.3
N$180  (via drill 0.6)
  Top 0.203: RD15.1 19,7.64 QOF15.3 19.06,7.62 v20.24,7.68
  Bottom 0.203: QON15.1 18.7,8.66 19.89,8.64 v20.24,7.68
N$184  (via drill 0.6)
  Top 0.203: v12.8,10.71 11.51,10.61 QOF16.1 10.62,8.76 8.94,8.69 8.14,9.03 6.75,9.03 v5.59,6.98 | COF16.1 14.18,8.35 v14.71,9.07
  Bottom 0.203: v12.8,10.71 RG16.1 13.16,9.44 v14.71,9.07 | Z16.3 5.56,8.42 v5.59,6.98
N$185  (via drill 0.6)
  Top 0.203: RD16.1 9.95,7.76 QOF16.3 9.99,7.57 v11.48,7.77
  Bottom 0.203: QON16.1 9.93,8.76 10.86,8.72 v11.48,7.77
VDD
  Top 0.203: U$2.9 19.01,24.69 16.43,20.17 | U$2.18 16.5,18.01 16.43,20.17 | 16.43,20.17 5.03,25.38 3.96,25.38 JP3.2
  Bottom 0.203: R3.1 9.35,15.59 R2.1 9.35,18.22 R1.1 9.45,19.39 5.25,24.86 3.9,25.38 JP3.2
  pour Bottom (rank 3): 1.45,27.06 6.26,27.12 19.73,25.57 19.67,16.88 9.37,11.89 8,11.92 7.86,20.25 1.5,20.99

### Text on the board
bNames: 5
tValues: 3.3V | DIGITAL | +5V | 3.2v | ANALOG | 3.2